# EAGLE design lever-arena (EAGLE 7.6.0)

## Sheet 1 of 2
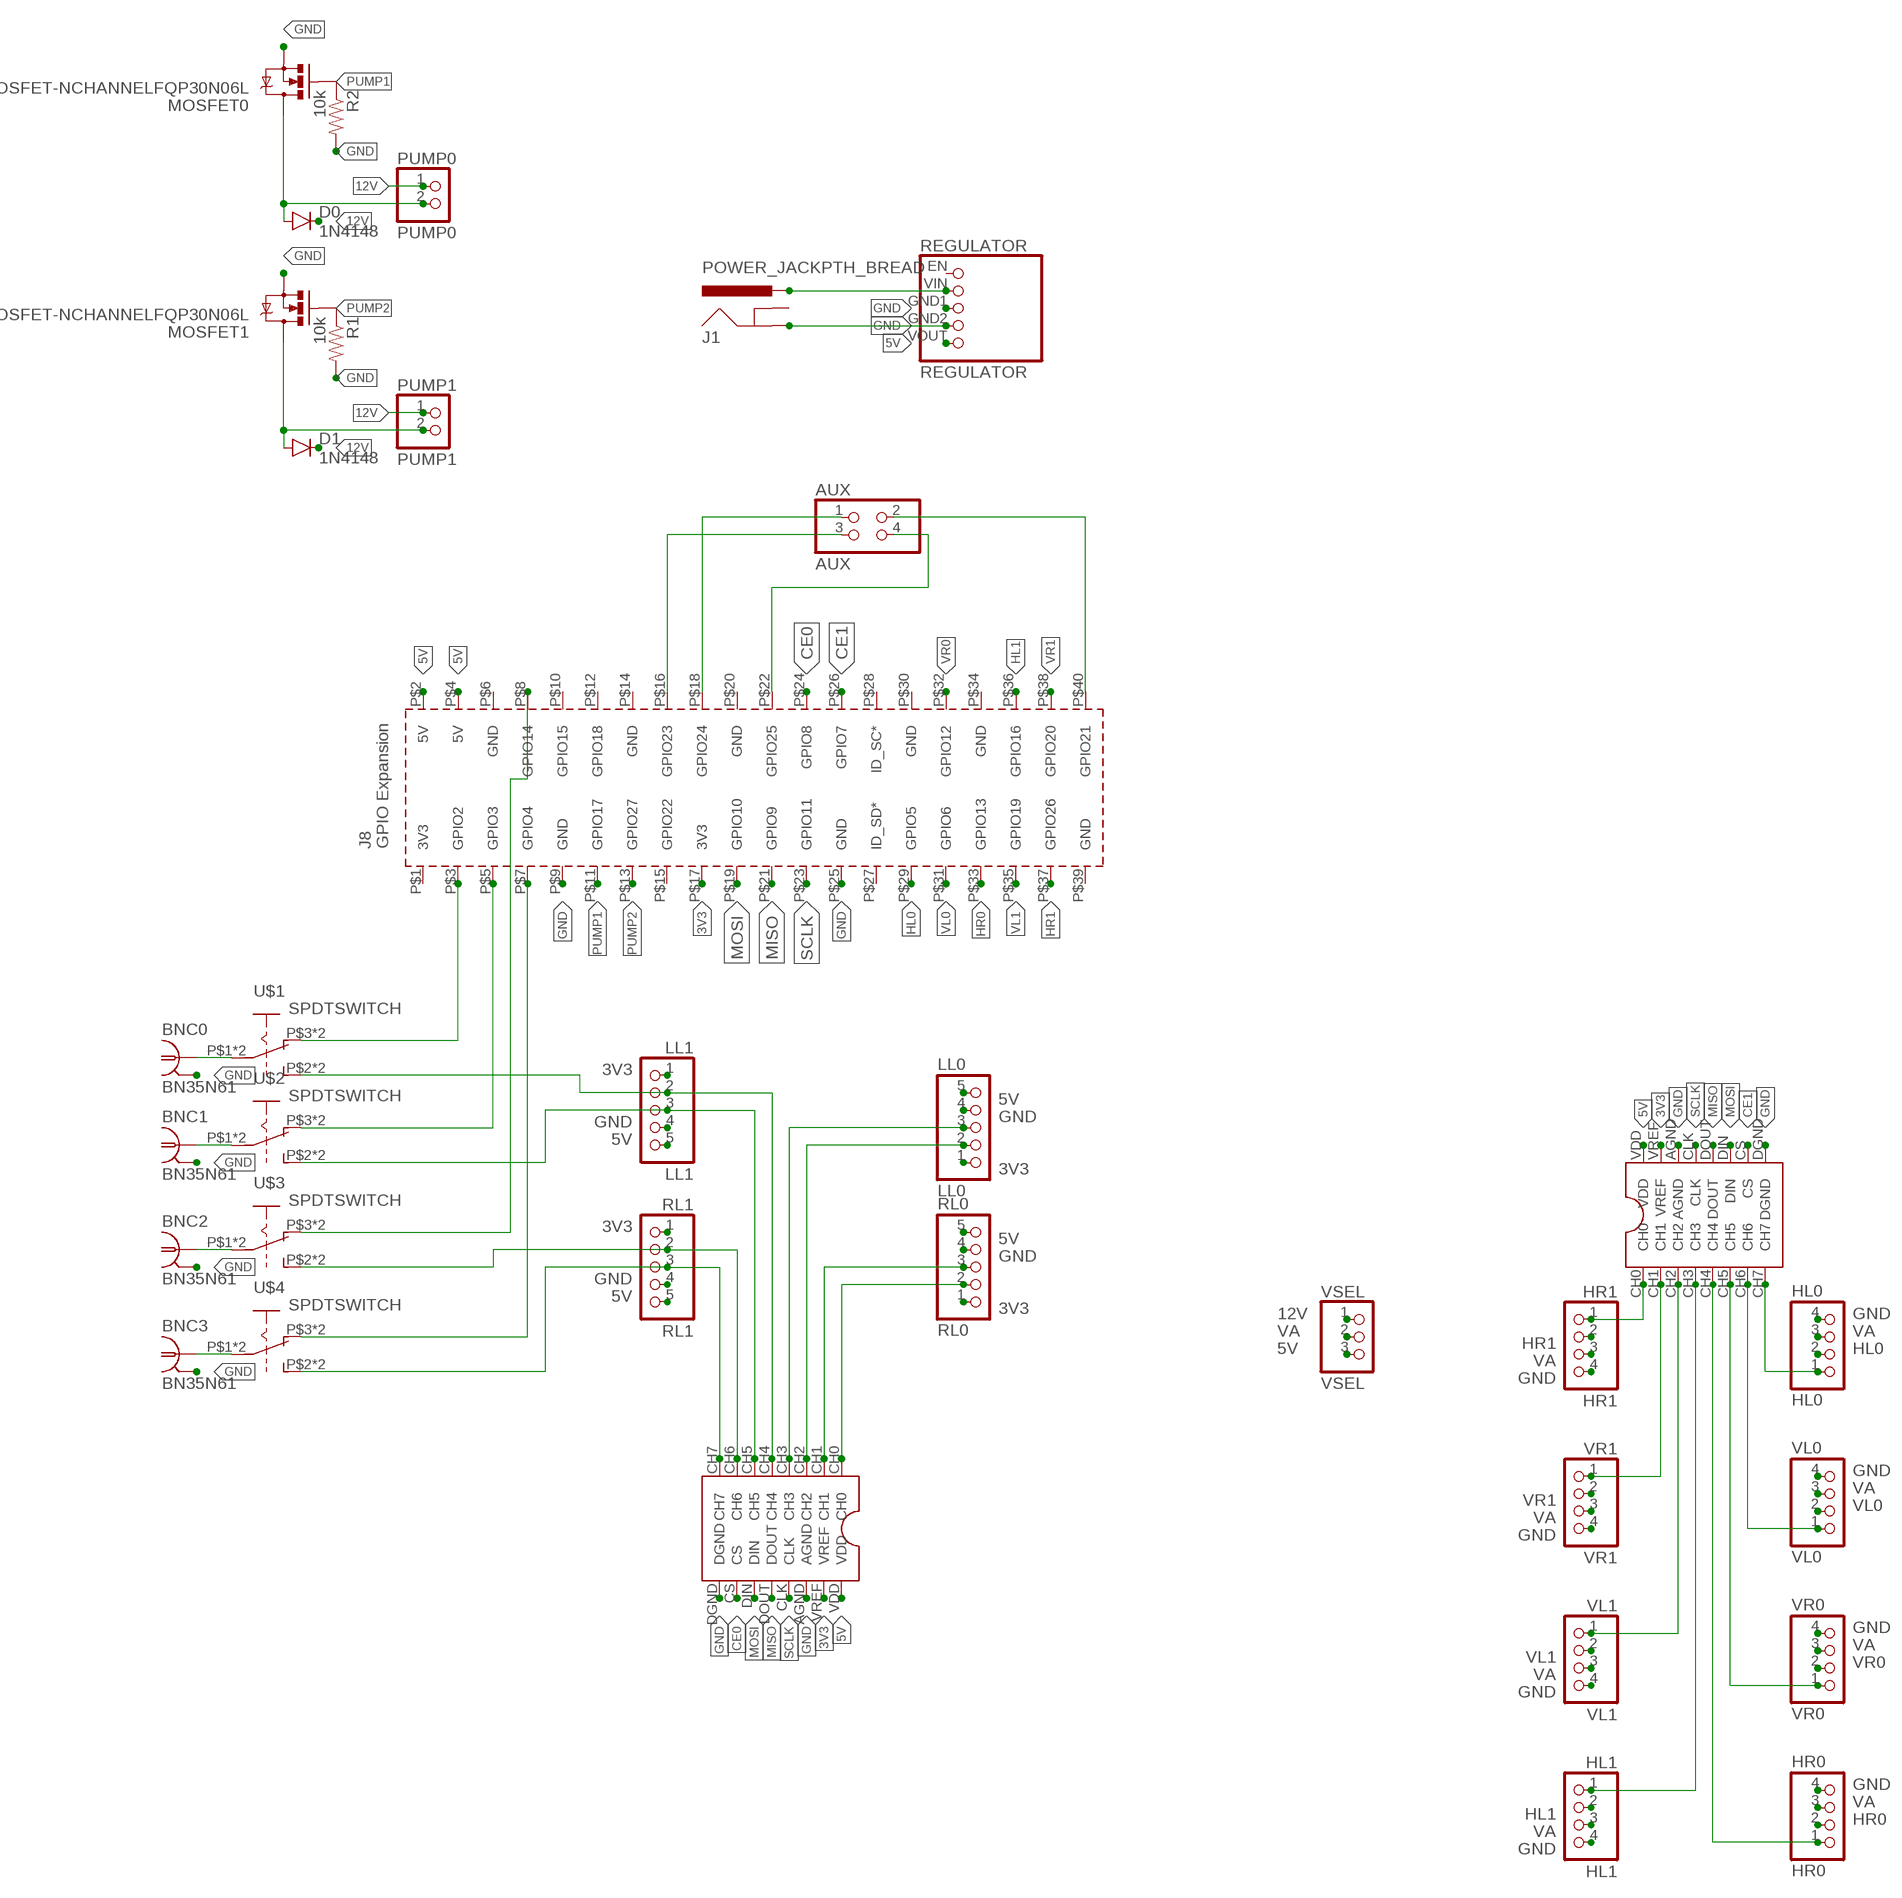
[diagram p0: schematic, sheet 1]

### Parts
ADC0  MCP3208  [MCP3208-CI/SL]
ADC1  MCP3208  [MCP3208-CI/SL]
AUX  AUX  PINHD-2X2  [2X02]
BNC0  BN35N61  [B35N61]
BNC1  BN35N61  [B35N61]
BNC2  BN35N61  [B35N61]
BNC3  BN35N61  [B35N61]
D0  1N4148  DIODE1N4148  [DIODE-1N4148]
D1  1N4148  DIODE1N4148  [DIODE-1N4148]
HL0  HL0  PINHD-1X4  [1X04]
HL1  HL1  PINHD-1X4  [1X04]
HR0  HR0  PINHD-1X4  [1X04]
HR1  HR1  PINHD-1X4  [1X04]
J1  POWER_JACKPTH_BREAD  [POWER_JACK_PTH_BREAD]
LL0  LL0  PINHD-1X5  [1X05]
LL1  LL1  PINHD-1X5  [1X05]
MOSFET0  MOSFET-NCHANNELFQP30N06L  [TO220V]
MOSFET1  MOSFET-NCHANNELFQP30N06L  [TO220V]
PCB1  RPI3  [RPI3H]
PUMP0  PUMP0  PINHD-1X2  [1X02]
PUMP1  PUMP1  PINHD-1X2  [1X02]
R1  10k  10KOHM-1/4W-1%(PTH)HORIZ  [AXIAL-0.3]
R2  10k  10KOHM-1/4W-1%(PTH)HORIZ  [AXIAL-0.3]
REGULATOR  REGULATOR  POLULU5VREGULATORNORMAL  [POLOLU5V]
RL0  RL0  PINHD-1X5  [1X05]
RL1  RL1  PINHD-1X5  [1X05]
U$1  SPDTSWITCH  [JS202011CQNSPDT]
U$2  SPDTSWITCH  [JS202011CQNSPDT]
U$3  SPDTSWITCH  [JS202011CQNSPDT]
U$4  SPDTSWITCH  [JS202011CQNSPDT]
VL0  VL0  PINHD-1X4  [1X04]
VL1  VL1  PINHD-1X4  [1X04]
VR0  VR0  PINHD-1X4  [1X04]
VR1  VR1  PINHD-1X4  [1X04]
VSEL  VSEL  PINHD-1X3  [1X03]

### Nets
3V3: ADC0.VREF ADC1.VREF LL0.1 LL1.1 PCB1.P$17(3V3) RL0.1 RL1.1
5V: ADC0.VDD ADC1.VDD LL0.5 LL1.5 PCB1.P$2(5V) PCB1.P$4(5V) REGULATOR.VOUT RL0.5 RL1.5 VSEL.3
12V: D0.C D1.A D1.C J1.PWR MOSFET1.2(D) PUMP0.1 PUMP1.1 PUMP1.2 REGULATOR.VIN VSEL.1
CE0: ADC0.CS PCB1.P$24(GPIO8)
CE1: ADC1.CS PCB1.P$26(GPIO7)
GND: ADC0.AGND ADC0.DGND ADC1.AGND ADC1.DGND BNC0.2 BNC0.3 BNC0.4 BNC0.5 BNC1.2 BNC1.3 BNC1.4 BNC1.5 BNC2.2 BNC2.3 BNC2.4 BNC2.5 BNC3.2 BNC3.3 BNC3.4 BNC3.5 HL0.4 HL1.4 HR0.4 HR1.4 J1.GND LL0.4 LL1.4 MOSFET0.3(S) MOSFET1.3(S) PCB1.P$9(GND) PCB1.P$25(GND) R1.P$2 R2.P$2 REGULATOR.GND1 REGULATOR.GND2 RL0.4 RL1.4 VL0.4 VL1.4 VR0.4 VR1.4
HL0: HL0.2 PCB1.P$29(GPIO5)
HL1: HL1.2 PCB1.P$36(GPIO16)
HR0: HR0.2 PCB1.P$33(GPIO13)
HR1: HR1.2 PCB1.P$37(GPIO26)
MISO: ADC0.DOUT ADC1.DOUT PCB1.P$21(GPIO9)
MOSI: ADC0.DIN ADC1.DIN PCB1.P$19(GPIO10)
N$1: PCB1.P$8(GPIO14) U$3.P$3(O) U$3.P$6(O)
N$3: ADC1.CH0 HR1.1
N$4: D0.A MOSFET0.2(D) PUMP0.2
N$5: PCB1.P$7(GPIO4) U$4.P$3(O) U$4.P$6(O)
N$6: BNC0.1 U$1.P$1(P) U$1.P$5(P)
N$7: PCB1.P$5(GPIO3) U$2.P$3(O) U$2.P$6(O)
N$8: PCB1.P$3(GPIO2) U$1.P$3(O) U$1.P$6(O)
N$9: BNC1.1 U$2.P$1(P) U$2.P$5(P)
N$10: BNC2.1 U$3.P$1(P) U$3.P$5(P)
N$11: BNC3.1 U$4.P$1(P) U$4.P$5(P)
N$12: ADC1.CH7 HL0.1
N$13: ADC0.CH3 LL0.3
N$14: ADC0.CH2 LL0.2
N$15: ADC0.CH1 RL0.3
N$16: ADC1.CH6 VL0.1
N$17: ADC0.CH0 RL0.2
N$18: AUX.3 PCB1.P$16(GPIO23)
N$19: AUX.1 PCB1.P$18(GPIO24)
N$20: ADC1.CH5 VR0.1
N$21: AUX.4 PCB1.P$22(GPIO25)
N$22: AUX.2 PCB1.P$40(GPIO21)
N$28: ADC1.CH3 HL1.1
N$32: ADC1.CH2 VL1.1
N$33: ADC0.CH5 LL1.3 U$2.P$2(S) U$2.P$4(S)
N$34: ADC0.CH4 LL1.2 U$1.P$2(S) U$1.P$4(S)
N$36: ADC1.CH1 VR1.1
N$39: ADC0.CH7 RL1.3 U$4.P$2(S) U$4.P$4(S)
N$40: ADC0.CH6 RL1.2 U$3.P$2(S) U$3.P$4(S)
NGNG: ADC1.CH4 HR0.1
PUMP1: MOSFET0.1(G) PCB1.P$11(GPIO17) R2.P$1
PUMP2: MOSFET1.1(G) PCB1.P$13(GPIO27) R1.P$1
SCLK: ADC0.CLK ADC1.CLK PCB1.P$23(GPIO11)
VA: HL0.3 HL1.3 HR0.3 HR1.3 VL0.3 VL1.3 VR0.3 VR1.3 VSEL.2
VL0: PCB1.P$31(GPIO6) VL0.2
VL1: PCB1.P$35(GPIO19) VL1.2
VR0: PCB1.P$32(GPIO12) VR0.2
VR1: PCB1.P$38(GPIO20) VR1.2
Unconnected: J1.GNDBREAK PCB1.P$1(3V3) PCB1.P$6(GND) PCB1.P$10(GPIO15) PCB1.P$12(GPIO18) PCB1.P$14(GND) PCB1.P$15(GPIO22) PCB1.P$20(GND) PCB1.P$27(ID_SD*) PCB1.P$28(ID_SC*) PCB1.P$30(GND) PCB1.P$34(GND) PCB1.P$39(GND) REGULATOR.EN

## Sheet 2 of 2

## Library data of the parts
ADC0 ADC1 = spencer:MCP3208
AUX = pinhead:PINHD-2X2: PIN HEADER
BNC0 BNC1-BNC3 = con-coax:BN35N61: BNC CONNECTOR M/A COM www.macom.com distributor Farnell 149-452; OC_FARNELL: unknown; OC_NEWARK: unknown
D0 D1 = SparkFun-DiscreteSemi:DIODE: Diode These are standard reverse protection diodes and small signal diodes. SMA package can handle up to about 1A. SOD-323 can handle about 200mA. What the SOD-323 package when ordering, there are some mfgs out there that are 5-pin packages.; PROD_ID: DIO-08378
HL0 HL1 HR0 HR1 VL0 VL1 VR0 VR1 = pinhead:PINHD-1X4: PIN HEADER
J1 = SparkFun-Connectors:POWER_JACK: Power Jack This is the standard 5.5mm barrel jack for power. The PTH is the most common, proven, reliable, footprint. The Slot footprint only works if the mill layer is transmitted to the PCB fab house so be warned. Mating wall wart : TOL-00298 (and others); PROD_ID: PRT-10811
LL0 LL1 RL0 RL1 = pinhead:PINHD-1X5: PIN HEADER
MOSFET0 MOSFET1 = SparkFun-DiscreteSemi:MOSFET-NCHANNEL: Common NMOSFET Parts MFG P/N Store ID Prod ID FDD8780 TRANS-09984 SI7820DN TRANS-11055 FDS6630A IC-08089 2N7002PW TRANS-11151 FQP30N06L COM-10213 TRANS-10060 BSS123LT1G TRANS-08345 BSS138 TRANS-00830 BS170 2N7000; PROD_ID: TRANS-10060
PCB1 = spencer:RPI3: Device for Raspberry Pi 3 board created by Dave Young for www.element14.com More information and support community is available at https://www.element14.com/community/community/raspberry-pi
PUMP0 PUMP1 = pinhead:PINHD-1X2: PIN HEADER
R1 R2 = SparkFun-Resistors:10KOHM-1/4W-1%(PTH): RES-12183; PROD_ID: RES-12183
REGULATOR = spencer:POLULU5VREGULATOR: PIN HEADER
U$1-U$4 = spencer:SPDTSWITCH
VSEL = pinhead:PINHD-1X3: PIN HEADER

## Board
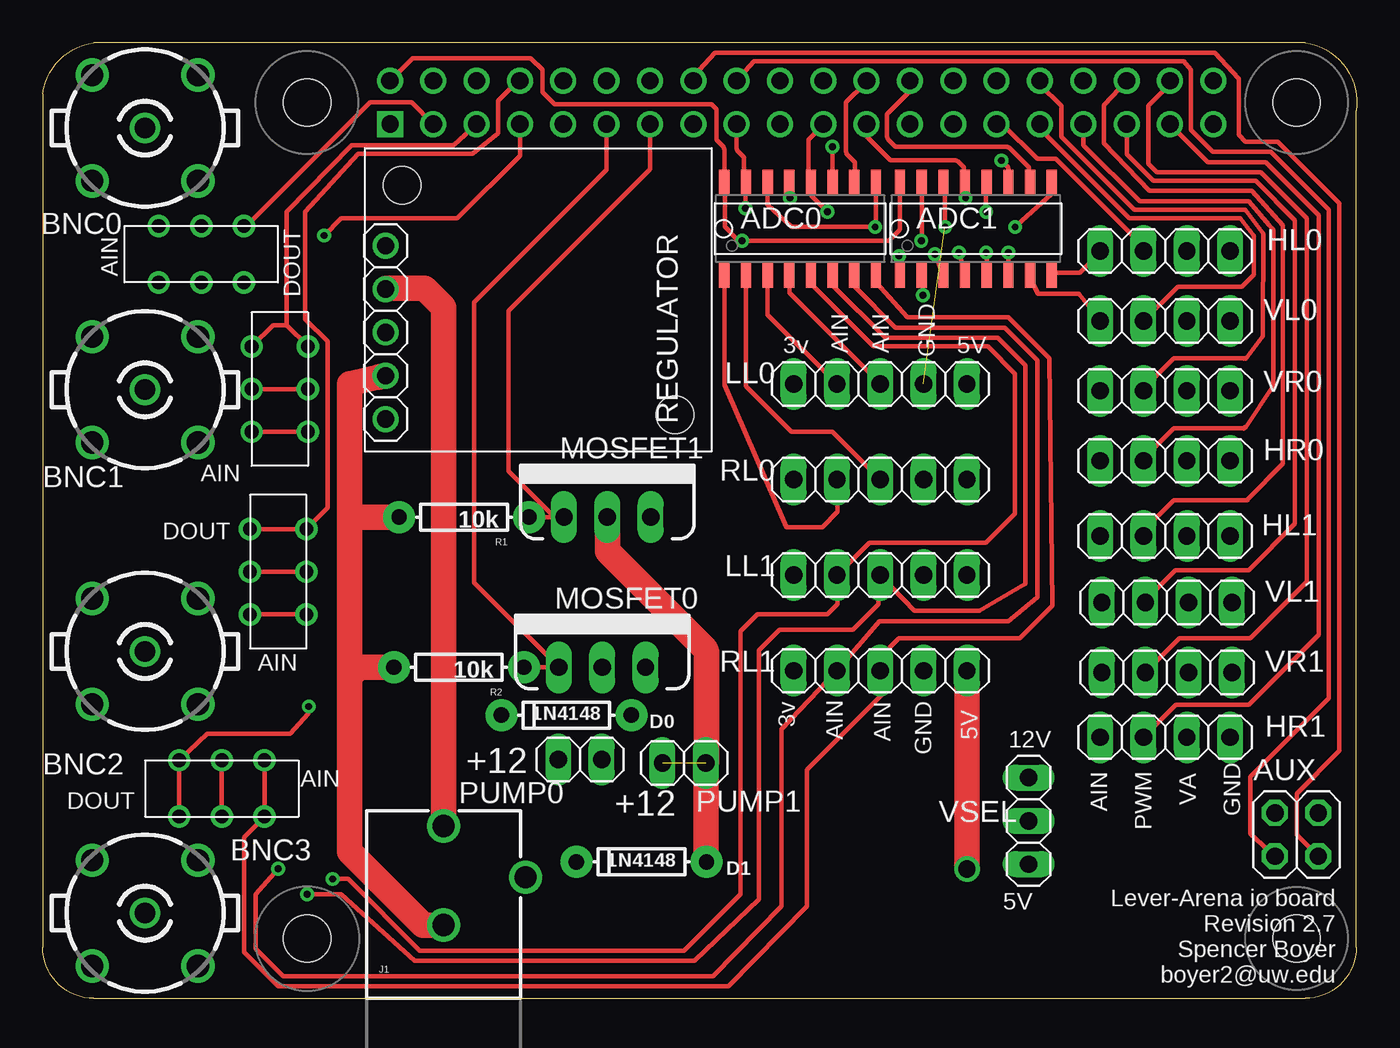
[diagram p1: board, top side]
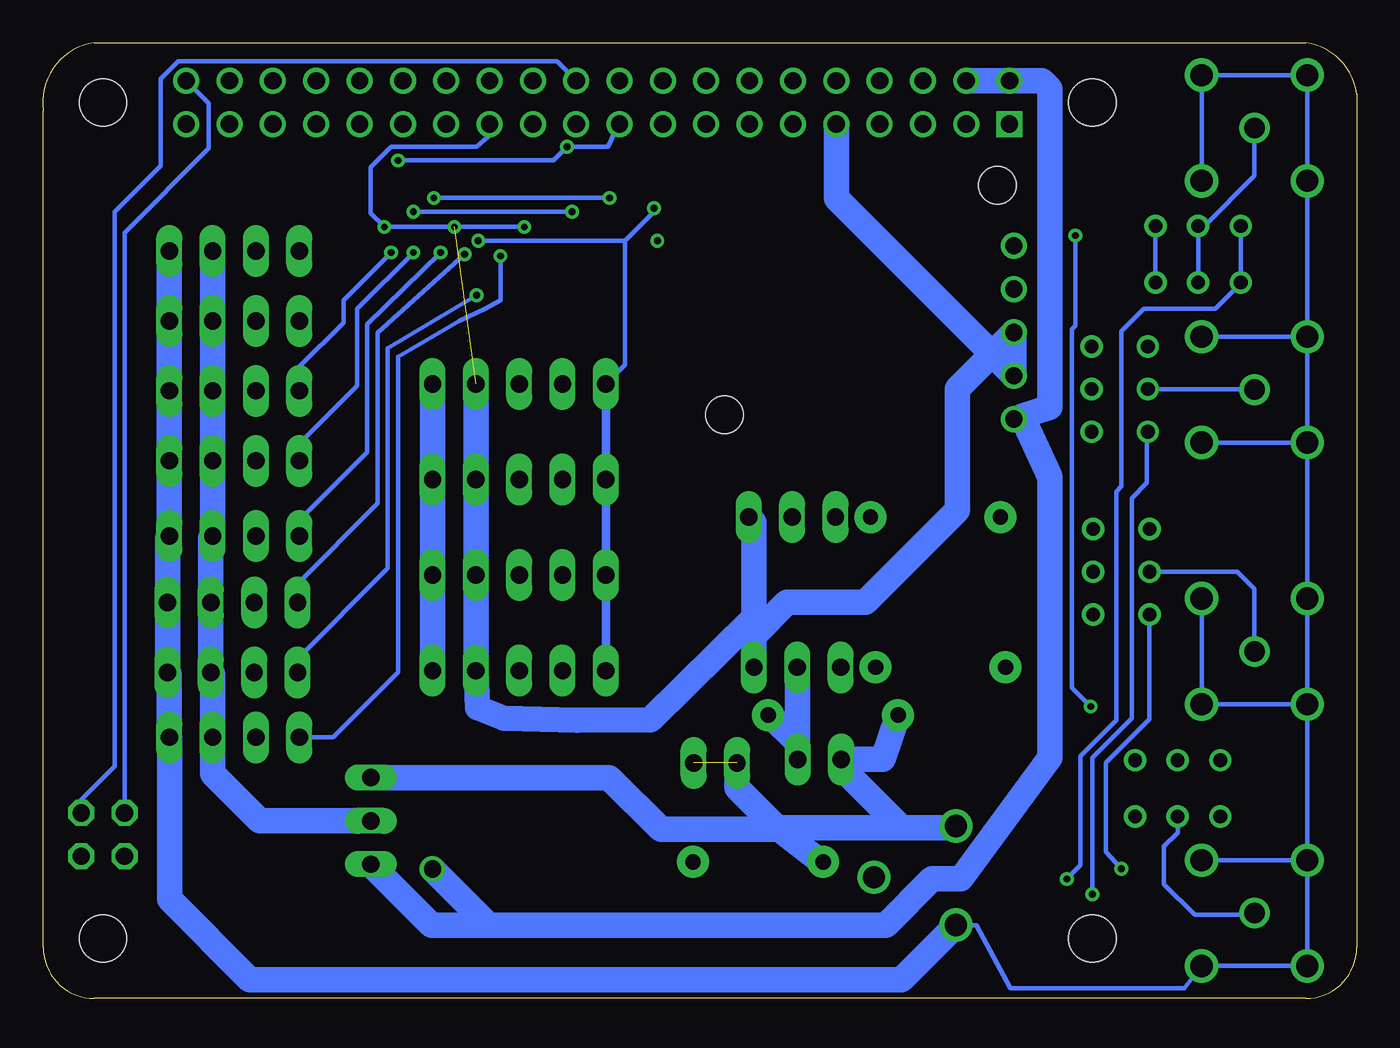
[diagram p2: board, bottom side, seen from below]

Size 77.03 x 56 mm. Coordinates in mm from the lower left corner, seen from the top.
Outline: 3,0 74,0 arc90 77,3 77,52 arc90 74,56 3,56 arc74 0,53 0,3 arc90 3,0
Copper layers (1*16): Top 0.035mm / dielectric 1.5mm / Bottom 0.035mm
Design rules "default *": minimum track width 10mil, minimum drill 0.4mm, track to track 8mil, track to pad 8mil, pad to pad 8mil, via to via 8mil, smd to smd 8mil, copper to edge 10mil, drill to drill 8mil, minimum pad ring 10mil, minimum via ring 8mil, stop-mask expansion 4mil, vias tented up to drill 0mil, thermal gap 10mil

### Footprints (pad centres in the part's own frame; a part is rotated, then mirrored left to right if it is on the bottom)
MCP3208-CI/SL = smd 0.6 x 1.5: AGND -1.905,2.7; CH0 -4.445,-2.7; CH1 -3.175,-2.7; CH2 -1.905,-2.7; CH3 -0.635,-2.7; CH4 0.635,-2.7; CH5 1.905,-2.7; CH6 3.175,-2.7; CH7 4.445,-2.7; CLK -0.635,2.7; CS 3.175,2.7; DGND 4.445,2.7; DIN 1.905,2.7; DOUT 0.635,2.7; VDD -4.445,2.7; VREF -3.175,2.7
2X02 = drill 1.016 octagon: 1 -1.27,-1.27; 2 -1.27,1.27; 3 1.27,-1.27; 4 1.27,1.27
B35N61 = drill 1.2: 1 0,0 | drill 1.3: 2 3.099,3.099; 3 -3.099,3.099; 4 -3.099,-3.099; 5 3.099,-3.099
DIODE-1N4148 = drill 0.9 pad 1.88: A -3.81,0; C 3.81,0
1X04 = drill 1.016 long: 1 -3.81,0; 2 -1.27,0; 3 1.27,0; 4 3.81,0
POWER_JACK_PTH_BREAD = drill 1.3: GND 0,7.9; GNDBREAK 4.8,10.7; PWR 0,13.7
1X05 = drill 1.016 long: 1 -5.08,0; 2 -2.54,0; 3 0,0; 4 2.54,0; 5 5.08,0
TO220V = drill 1.016 long: 1 -2.54,0; 2 0,0; 3 2.54,0
RPI3H = drill 1.016 square: P$1 8.37,51.23 | drill 1.016: P$2 8.357,53.772; P$3 10.897,51.232; P$4 10.897,53.772; P$5 13.437,51.232; P$6 13.437,53.772; P$7 15.977,51.232; P$8 15.977,53.772; P$9 18.517,51.232; P$10 18.517,53.772; P$11 21.057,51.232; P$12 21.057,53.772; P$13 23.597,51.232; P$14 23.597,53.772; P$15 26.137,51.232; P$16 26.137,53.772; P$17 28.677,51.232; P$18 28.677,53.772; P$19 31.217,51.232; P$20 31.217,53.772; P$21 33.757,51.232; P$22 33.757,53.772; P$23 36.297,51.232; P$24 36.297,53.772; P$25 38.837,51.232; P$26 38.837,53.772; P$27 41.377,51.232; P$28 41.377,53.772; P$29 43.917,51.232; P$30 43.917,53.772; P$31 46.457,51.232; P$32 46.457,53.772; P$33 48.997,51.232; P$34 48.997,53.772; P$35 51.537,51.232; P$36 51.537,53.772; P$37 54.077,51.232; P$38 54.077,53.772; P$39 56.617,51.232; P$40 56.617,53.772 | hole 2.75: 3.5,3.5; 61.5,3.5; 3.5,52.5; 61.5,52.5
1X02 = drill 1.016 long: 1 -1.27,0; 2 1.27,0
AXIAL-0.3 = drill 0.9 pad 1.88: P$1 -3.81,0; P$2 3.81,0
POLOLU5V = drill 1.016: EN 0,0; GND1 5.08,0; GND2 7.62,0; VIN 2.54,0; VOUT 10.16,0 | hole 2.184: -3.556,0.958; 9.906,16.96
JS202011CQNSPDT = drill 0.8: P$1 0,1.65; P$2 2.5,1.65; P$3 -2.5,1.65; P$4 2.5,-1.65; P$5 0,-1.65; P$6 -2.5,-1.65
1X03 = drill 1.016 long: 1 -2.54,0; 2 0,0; 3 2.54,0

### Placement (x,y rotation side)
ADC0  44.4,45.1 0 top
ADC1  54.7,45.1 0 top
AUX  73.5,9.6 0 top
BNC0  6,51 0 top
BNC1  6,35.67 0 top
BNC2  6,20.33 0 top
BNC3  6,5 0 top
D0  30.7,16.6 180 top
D1  35.1,8 180 top
HL0  65.8,43.8 0 top
HL1  65.8,27.1 0 top
HR0  65.8,31.5 0 top
HR1  65.8,15.3 0 top
J1  23.5,-3.6 0 top
LL0  49.1,36 0 top
LL1  49.1,24.8 0 top
MOSFET0  32.8,19.4 0 top
MOSFET1  33.1,28.2 0 top
PCB1  12,0 0 top
PUMP0  31.5,14 0 top
PUMP1  37.6,13.8 0 top
R1  24.7,28.2 180 top
R2  24.4,19.4 180 top
REGULATOR  20.1,44.1 270 top
RL0  49.1,30.4 0 top
RL1  49.1,19.2 0 top
U$1  9.3,43.6 180 top
U$2  13.9,35.7 270 top
U$3  13.8,25 270 top
U$4  10.5,12.3 0 top
VL0  65.8,39.7 0 top
VL1  65.9,23.2 0 top
VR0  65.8,35.6 0 top
VR1  65.9,19.1 0 top
VSEL  57.8,10.4 270 top

### Tracks (layer width: path | path; a pad name or v marks a point on that pad's centre or on a via)
3V3  (via drill 0.4)
  Top 0.254: v41.2,46.3 41.23,47.77 ADC0.VREF 41.17,47.85 arc-45 41.1,48.03 41.1,49.3 40.75,49.65 arc-45 40.68,49.83 PCB1.P$17 | ADC1.VREF 51.52,44.42 v51.5,44.4
  Bottom 0.254: v41.2,46.3 41.2,46.1 42.9,44.4 | 42.9,44.4 v51.5,44.4 | 42.9,44.4 42.9,37.12 LL0.1
  Bottom 0.5: RL1.1 LL1.1 RL0.1 LL0.1
5V  (via drill 0.4, 1)
  Top 0.254: ADC1.VDD 50.26,45.16 arc-45 50.18,44.98 49.6,44.4 v41,44.4 40.8,44.4 40,45.2 40,47.76 ADC0.VDD 39.95,49.74 arc45 39.88,49.92 39.5,50.3 39.5,52.1 39.2,52.4 30,52.4 29.3,53.1 29.3,54.4 28.6,55.1 21.68,55.1 PCB1.P$2
  Top 1.5: RL1.5 v54.18,7.58
  Bottom 1.5: 19.63,34.1 18,34.64 18,53.3 18.47,53.77 PCB1.P$2 PCB1.P$4 | 19.63,34.1 REGULATOR.VOUT | 19.63,34.1 18,30.56 18,14.1 23.2,7 24.9,7 27.6,4.3 50.9,4.3 | 50.9,4.3 54.24,4.3 VSEL.3 | RL1.5 LL1.5 RL0.5 LL0.5 | v54.18,7.58 50.9,4.3
12V  (1 unrouted)
  Top 1.5: MOSFET1.2 33.1,26.2 38.83,20.47 arc-45 38.9,20.3 38.9,13.83 PUMP1.2 38.87,8.04 D1.A | J1.PWR 23.5,40.5 22.4,41.6 20.14,41.6 REGULATOR.VIN
  Bottom 1.5: PUMP1.1 36.33,12.33 34,10 | 34,10 32.4,10 | 32.4,10 26.7,10 | 26.7,10 23.6,10 J1.PWR | D0.C 27.79,14 PUMP0.1 30.23,13.53 26.7,10 | D1.C 31.8,8.3 34,10 | VSEL.1 43.84,12.94 40.8,9.9 32.5,9.9 32.4,10
CE0
  Top 0.254: PCB1.P$24 arc-45 48.24,53.64 47.1,52.5 47.1,49.6 arc45 47.17,49.43 47.6,49 47.6,47.86 arc-45 ADC0.CS
CE1
  Top 0.254: PCB1.P$26 50.84,53.24 arc-45 50.76,53.06 49.5,51.8 49.5,50.51 arc45 49.57,50.33 50,49.9 56.49,49.9 arc-45 56.77,49.73 57.8,48.7 57.8,47.98 arc45 ADC1.CS
GND  (via drill 0.4)  (1 unrouted)
  Top 0.254: ADC1.DGND 59.15,47.15 57.1,45.3 v57,45.2 | v52.9,45.2 52.9,47.7 ADC1.AGND | 18.1,19.4 18.07,18.93 18,17.9 | ADC0.DGND 48.84,45.15 v48.8,45.2 43.9,45.2 42.49,46.51 ADC0.AGND
  Top 1.5: J1.GND 22.3,4.3 18,8.6 18,17.9 18,28.2 | 18,28.2 18,36 19.62,36.4 REGULATOR.GND2 | R1.P$2 18,28.2 | R2.P$2 18.53,19.4 18.07,18.93
  Bottom 0.254: PCB1.P$25 50.84,50.67 arc45 50.91,50.49 51.6,49.9 56.6,49.9 57.8,48.7 57.8,46 v57,45.2 v52.9,45.2 v48.8,45.2 | BNC1.3 BNC1.4 | J1.GND 22.3,4.3 20.3,0.6 17.5,0.6 10.1,0.6 BNC3.5 BNC3.4 BNC3.3 | BNC2.4 BNC3.3 | BNC2.4 BNC2.3 BNC1.4 | BNC1.3 BNC0.4 BNC0.3 BNC0.2 BNC0.5 | BNC1.2 BNC1.3 | BNC1.5 BNC1.4 | BNC2.4 BNC2.5 BNC2.2 | BNC3.2 BNC3.3
  Bottom 1.5: 35.34,22.3 MOSFET0.3 35.34,21.26 33.4,23.2 28.8,23.2 23.4,28.6 23.4,35.72 REGULATOR.GND1 REGULATOR.GND2 30.52,46.9 PCB1.P$9 | 35.34,22.3 35.34,27.8 arc-45 35.41,27.97 MOSFET1.3 | HL0.4 VL0.4 VR0.4 HR0.4 HL1.4 69.71,27 VL1.4 VR1.4 69.61,19 HR1.4 69.6,5.8 64.9,1.1 26.7,1.1 J1.GND | 35.34,22.3 41.4,16.34 45.7,16.3 50,16.4 51.54,17.04 RL1.4 LL1.4 RL0.4 LL0.4
HL0
  Top 0.254: PCB1.P$29 56.27,51.23 58.3,49.2 59.4,49.2 63.9,44.7 63.9,44.43 HL0.2
HL1
  Top 0.254: HL1.2 64.53,27.43 66.3,29.2 70.6,29.2 70.64,29.26 72.69,31.32 72.69,45.29 70.87,47.32 64.88,47.32 62.2,50.1 62.2,52.34 PCB1.P$36
HR0
  Top 0.254: PCB1.P$33 61,50 64.3,46.7 70.7,46.7 71.9,45.3 72.01,45.16 72.14,45.03 72.14,35.89 70.51,33.46 70.41,33.38 70.4,33.4 | HR0.2 64.53,31.63 66.3,33.4 70.4,33.4 | 70.4,33.4 70.5,33.5
HR1
  Top 0.254: PCB1.P$37 68.3,49 71.7,49 74.8,45.9 74.8,21.3 70.7,17.2 66.43,17.2 HR1.2
MISO  (via drill 0.4)
  Top 0.254: ADC1.DOUT 55.3,47.77 v55.3,46.1 | v46,46.1 45.03,47.06 ADC0.DOUT 44.97,47.86 arc-45 44.9,48.04 44.9,50.3 45.7,51.1 arc45 PCB1.P$21
  Bottom 0.254: v46,46.1 v55.3,46.1
MOSI  (via drill 0.4)
  Top 0.254: v46.3,49.9 ADC0.DIN | ADC1.DIN 56.6,48.59 arc45 56.53,48.77 v56.2,49.1
  Bottom 0.254: PCB1.P$19 43.27,51.23 43.9,49.9 v46.3,49.9 47.03,49.17 arc45 47.2,49.1 v56.2,49.1
N$1
  Top 0.254: PCB1.P$8 27.87,53.77 26.7,52.6 26.7,50.7 25.2,49.5 18.5,49.5 15.4,46.1 15.4,39.8 16.7,38.5 16.7,28.75 U$3.P$3 U$3.P$6
N$3  (via drill 0.4)
  Top 0.254: ADC1.CH0 50.26,43.55 v50.2,43.5
  Bottom 0.254: HR1.1 60,15.3 56.2,19.1 56.2,37.6 52.6,39.7 51.1,40.4 50.2,40.9 v50.2,43.5
N$4
  Bottom 1.5: MOSFET0.2 32.8,15 | 32.8,15 32.8,14.03 PUMP0.2 | D0.A 34.4,16.6 32.8,15
N$5  (via drill 0.4)
  Top 0.254: PCB1.P$7 27.98,49.38 24.3,45.7 17.5,45.7 v16.5,44.7 | v15.6,17.1 15.6,16.7 14.5,15.5 9.65,15.5 U$4.P$3 U$4.P$6
  Bottom 0.254: v16.5,44.7 16.5,39.4 16.7,39.2 16.7,18.2 v15.6,17.1
N$6
  Bottom 0.254: BNC0.1 6,48.2 8.95,45.25 U$1.P$5 U$1.P$1
N$7
  Top 0.254: PCB1.P$5 24.1,50 18.1,50 14.3,46.1 14.3,39.45 | 14.3,39.45 U$2.P$3 | 14.3,39.45 13.5,39.45 U$2.P$6
N$8
  Top 0.254: U$1.P$6 11.8,45.5 12.2,45.5 19.2,52.5 21.63,52.5 PCB1.P$3
  Bottom 0.254: U$1.P$6 U$1.P$3
N$9
  Top 0.254: U$2.P$1 U$2.P$5
  Bottom 0.254: U$2.P$5 6.03,35.7 BNC1.1
N$10
  Top 0.254: U$3.P$1 U$3.P$5
  Bottom 0.254: U$3.P$5 7,25 6,24 BNC2.1
N$11
  Top 0.254: U$4.P$1 U$4.P$5
  Bottom 0.254: U$4.P$5 10.5,9.7 11.3,8.9 11.3,6.7 9.5,4.9 6.1,4.9 BNC3.1
N$12
  Top 0.254: ADC1.CH7 59.21,42.52 60.81,42.52 61.95,43.66 HL0.1
N$13
  Top 0.254: ADC0.CH3 43.77,41.34 LL0.3
N$14
  Top 0.254: ADC0.CH2 42.49,40.06 LL0.2
N$15
  Top 0.254: ADC0.CH1 41.23,35.88 43.9,33.2 46.3,33.2 RL0.3
N$16
  Top 0.254: ADC1.CH6 58.06,42.29 58.06,41.83 58.32,41.28 60.75,41.28 VL0.1
N$17
  Top 0.254: ADC0.CH0 39.95,35.95 43.6,27.6 45.7,27.6 46.6,28.5 46.6,30.36 RL0.2
N$18
  Top 0.254: PCB1.P$16 38.14,54.04 39.4,55.4 68.7,55.4 70.1,53.9 70.1,50.6 70.5,50.2 72.4,50.2 76,46.6 76,14.5 73.5,12 73.5,9.6 AUX.3
N$19
  Top 0.254: PCB1.P$18 41.7,54.9 66.9,54.9 67.3,54.4 67.3,50.9 68.6,49.6 72,49.6 75.4,46.2 75.4,17.6 70.8,13 70.8,9.66 AUX.1
N$20  (via drill 0.4)
  Top 0.254: ADC1.CH5 v56.6,43.7
  Bottom 0.254: VR0.1 61.99,37.01 59.4,39.6 59.4,40.9 v56.6,43.7
N$21
  Bottom 0.254: AUX.4 74.77,11.63 72.8,13.6 72.8,46.1 70.1,48.8 70.1,53.9 69.1,54.9 46.88,54.9 PCB1.P$22
N$22
  Bottom 0.254: AUX.2 72.23,44.87 67.3,49.8 67.3,52.45 PCB1.P$40
N$28  (via drill 0.4)
  Top 0.254: ADC1.CH3 53.87,43.23 v53.7,43.7
  Bottom 0.254: HL1.1 61.99,28.01 58,32 58,39.5 v53.7,43.7
N$32  (via drill 0.4)
  Top 0.254: ADC1.CH2 52.4,43.4 v52.3,43.6
  Bottom 0.254: VL1.1 62.09,24.31 57.4,29 57.4,39 v52.3,43.6
N$33  (via drill 0.4)
  Top 0.254: ADC0.CH5 46.3,41.8 49.4,38.7 56,38.7 57.6,37.1 57.6,24.3 54.9,22.7 51.1,22.7 LL1.3 49,24.7 49,23.1 47.5,21.6 43.2,21.6 42,20.4 42,5.8 38.2,2.2 21.8,2.2 17.5,6.1 v15.5,6.1 | U$2.P$2 U$2.P$4
  Bottom 0.254: U$2.P$4 12.3,33.2 12.3,30.2 13.2,29.3 13.2,16.4 15.5,14.1 v15.5,6.1
N$34  (via drill 0.4)
  Top 0.254: ADC0.CH4 45.03,41.87 48.7,38.2 55.4,38.2 57,36.6 57,28.4 55.3,26.7 48.46,26.7 LL1.2 46.6,24.76 46.6,23.1 46,22.5 41.9,22.5 40.9,21.5 40.9,6.1 37.6,2.8 22.1,2.8 17.9,7 v17,7
  Bottom 0.254: v17,7 16.2,7.8 16.2,14.2 14.1,16.3 14.1,29.7 13.8,30 13.8,39.1 12.5,40.4 8.3,40.4 6.8,41.9 U$1.P$2 U$1.P$4
N$36  (via drill 0.4)
  Top 0.254: v51.6,41.2 51.5,42.42 ADC1.CH1
  Bottom 0.254: VR1.1 62.09,19.91 56.8,25.2 56.8,38.1 v51.6,41.2
N$39
  Top 0.254: ADC0.CH7 48.84,41.95 50.7,39.9 56.6,39.9 59,37.5 59.17,23.01 57.27,21.1 50.2,21.1 49.2,20.1 49.2,19.1 | 49.2,19.1 49.2,17.8 44.8,13.4 44.8,5.4 40.2,0.7 13.8,0.7 11.8,2.7 11.8,9.45 U$4.P$4 U$4.P$2 | 49.2,19.1 RL1.3
N$40  (via drill 0.4)
  Top 0.254: ADC0.CH6 47.58,41.73 50,39.3 56.4,39.3 58.3,37.4 58.3,23.5 56.6,22.1 49.06,22.1 RL1.2 43.3,15.76 43.3,5.4 39.3,1.3 14.1,1.3 12.5,2.9 12.5,6.1 v13.8,7.6 | U$3.P$4 U$3.P$2
  Bottom 0.254: U$3.P$4 12.15,16.35 14.7,13.8 14.7,8.6 v13.8,7.6
NGNG  (via drill 0.4)
  Top 0.254: ADC1.CH4 55.34,43.66 v55.3,43.7
  Bottom 0.254: HR0.1 61.99,32.51 58.6,35.9 58.6,40.4 v55.3,43.7
PUMP1
  Top 0.254: MOSFET0.1 arc45 30.23,19.47 30.2,19.5 | R2.P$1 MOSFET0.1 | PCB1.P$11 33.06,48.56 25.3,40.8 25.3,24.36 MOSFET0.1
PUMP2
  Top 0.254: R1.P$1 30,28.2 | 30,28.2 MOSFET1.1 | PCB1.P$13 35.6,48.6 27.3,40.3 27.3,30.9 30,28.2
SCLK  (via drill 0.4)
  Top 0.254: PCB1.P$23 48.3,50.61 arc45 48.37,50.43 49.7,49.1 53.49,49.1 arc-45 53.67,49.03 54,48.7 54,47.96 arc45 ADC1.CLK 54.06,46.94 v54.1,46.9 | ADC0.CLK 43.77,46.94 v43.8,46.9
  Bottom 0.254: v43.8,46.9 v54.1,46.9
VA
  Bottom 1.5: HL0.3 VL0.3 VR0.3 HR0.3 HL1.3 67.17,27 VL1.3 VR1.3 67.07,19 HR1.3 67.07,13.17 64.3,10.4 VSEL.2
VL0
  Top 0.254: PCB1.P$31 58.46,50.94 63.7,45.7 70.2,45.7 71,44.7 71,42.4 70.3,41.7 66.53,41.7 VL0.2
VL1
  Top 0.254: VL1.2 64.63,23.33 66.4,25.1 70.7,25.1 73.4,27.8 73.4,45.6 71.1,47.9 65.1,47.9 63.54,49.46 PCB1.P$35
VR0
  Top 0.254: PCB1.P$32 58.46,53.54 59.7,52.3 59.7,50.5 64,46.2 70.5,46.2 71.5,44.9 71.55,44.81 71.55,42.29 71.52,41.66 71.52,38.79 70.51,37.48 70.41,37.5 | VR0.2 64.53,35.73 66.3,37.5 70.41,37.5 | 70.41,37.5 70.5,37.5 | 70.41,37.49 70.41,37.5
VR1
  Top 0.254: 64.63,19.33 VR1.2 66.63,21.1 70.8,21.1 74.1,24.4 74.1,45.7 71.4,48.4 65.3,48.4 64.8,48.9 64.8,52.3 66.08,53.58 PCB1.P$38

### Text on the board
tNames: AIN | DOUT | 3v | AIN | AIN | GND | 5V | AIN | DOUT | AIN | AIN | AIN | 5V | 3v | 12V | GND | +12 | AIN | PWM | VA | DOUT | AIN | +12 | GND | Lever-Arena io board / Revision 2.7 / Spencer Boyer / boyer2@uw.edu | 5V